# EAGLE design CNCdriver (EAGLE 7.7.0)
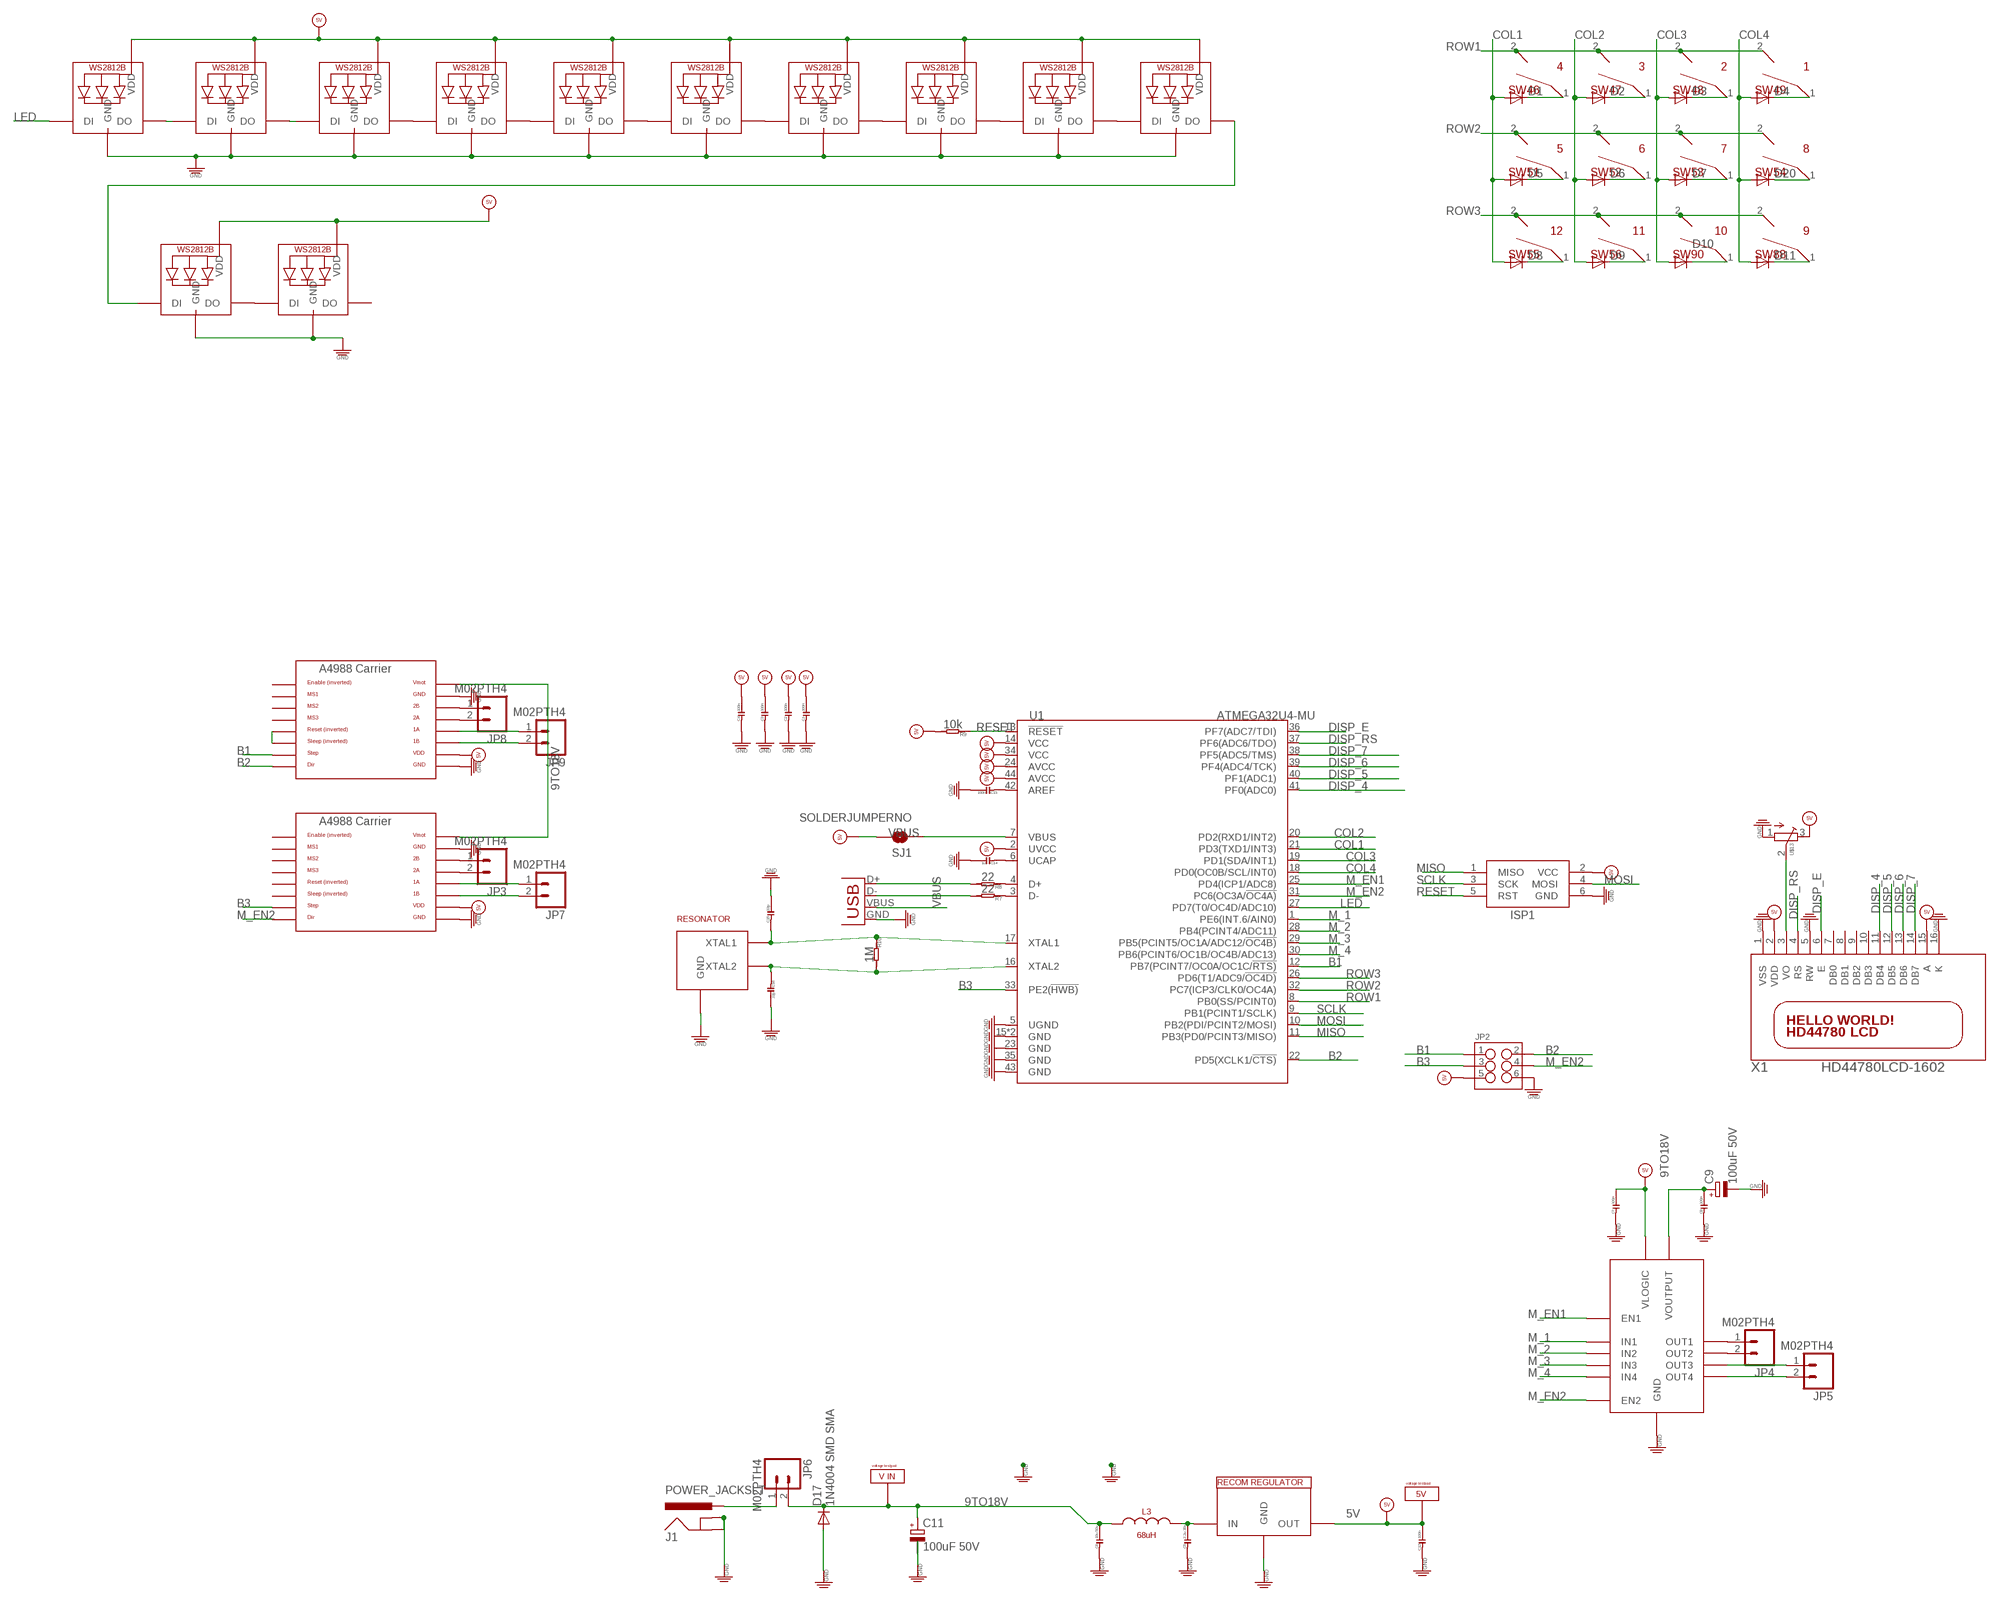
[diagram p0: schematic, sheet 1]

## Parts
C1  100n  C-0603  [C0603]
C2  100n  C-0603  [C0603]
C3  100n  C-0603  [C0603]
C4  100n  C-0603  [C0603]
C5  2.2u 35v  C-0603  [C0603]
C6  10u 50v  C-0603  [C0603]
C7  100n  C-0603  [C0603]
C8  100n  C-0603  [C0603]
C9  100uF 50V  CPOL-EU153CLV-1010  [153CLV-1010]
C11  100uF 50V  CPOL-EU153CLV-1010  [153CLV-1010]
C12  100n  C-0603  [C0603]
C13  100n  C-0603  [C0603]
C14  1u  C-0603  [C0603]
C15  22p  C-0603  [C0603]
C16  22p  C-0603  [C0603]
D1  CGRM4001-G  [SOD-123_MINI-SMA]
D2  CGRM4001-G  [SOD-123_MINI-SMA]
D3  CGRM4001-G  [SOD-123_MINI-SMA]
D4  CGRM4001-G  [SOD-123_MINI-SMA]
D5  CGRM4001-G  [SOD-123_MINI-SMA]
D6  CGRM4001-G  [SOD-123_MINI-SMA]
D7  CGRM4001-G  [SOD-123_MINI-SMA]
D8  CGRM4001-G  [SOD-123_MINI-SMA]
D9  CGRM4001-G  [SOD-123_MINI-SMA]
D10  CGRM4001-G  [SOD-123_MINI-SMA]
D11  CGRM4001-G  [SOD-123_MINI-SMA]
D17  1N4004 SMD SMA  DIODE-DO214AC  [DO214AC]
D20  CGRM4001-G  [SOD-123_MINI-SMA]
ISP1  AVRISP-6  [AVRISP]
J1  POWER_JACKSLT  [POWER_JACK_SLOT]
JP1  USB-B  USBPTH  [USB-B-PTH]
JP2  M03X2  [2X3-SHROUDED]
JP3  M02PTH4  [1X02_XTRA_BIG]
JP4  M02PTH4  [1X02_XTRA_BIG]
JP5  M02PTH4  [1X02_XTRA_BIG]
JP6  M02PTH4  [1X02_XTRA_BIG]
JP7  M02PTH4  [1X02_XTRA_BIG]
JP8  M02PTH4  [1X02_XTRA_BIG]
JP9  M02PTH4  [1X02_XTRA_BIG]
L3  68uH  L-SWRB1204S  [SWRB120XS]
LED13  WS2812B3535  [LED3535]
LED14  WS2812B3535  [LED3535]
LED15  WS2812B3535  [LED3535]
LED16  WS2812B3535  [LED3535]
LED17  WS2812B3535  [LED3535]
LED18  WS2812B3535  [LED3535]
LED19  WS2812B3535  [LED3535]
LED20  WS2812B3535  [LED3535]
LED21  WS2812B3535  [LED3535]
LED22  WS2812B3535  [LED3535]
LED23  WS2812B3535  [LED3535]
LED24  WS2812B3535  [LED3535]
R7  22  R-0603  [R0603]
R8  22  R-0603  [R0603]
R9  10k  R-0603  [R0603]
R10  1M  R-0603  [R0603]
SJ1  SOLDERJUMPERNO  [SJ_2S-NO]
SW46  4  CHERRY_MX_WITH_FIXING_PINS  [MX1A-XXNW]
SW47  3  CHERRY_MX_WITH_FIXING_PINS  [MX1A-XXNW]
SW48  2  CHERRY_MX_WITH_FIXING_PINS  [MX1A-XXNW]
SW49  1  CHERRY_MX_WITH_FIXING_PINS  [MX1A-XXNW]
SW51  5  CHERRY_MX_WITH_FIXING_PINS  [MX1A-XXNW]
SW52  6  CHERRY_MX_WITH_FIXING_PINS  [MX1A-XXNW]
SW53  7  CHERRY_MX_WITH_FIXING_PINS  [MX1A-XXNW]
SW54  8  CHERRY_MX_WITH_FIXING_PINS  [MX1A-XXNW]
SW55  12  CHERRY_MX_WITH_FIXING_PINS  [MX1A-XXNW]
SW56  11  CHERRY_MX_WITH_FIXING_PINS  [MX1A-XXNW]
SW88  9  CHERRY_MX_WITH_FIXING_PINS  [MX1A-XXNW]
SW90  10  CHERRY_MX_WITH_FIXING_PINS  [MX1A-XXNW]
U1  ATMEGA32U4-MU  [QFN44]
U$9  L293D  [SO20]
U$13  TRIMPOTTC33X  [TC33X]
U$15  A4983CARRIER  [A4988BREAKOUT]
U$16  A4983CARRIER  [A4988BREAKOUT]
U$17  RECOM_REGULATOR  [R-78E5.0-1.0]
U$25  VOLTAGETESTPAD  [POWERTESTPAD]
U$29  VOLTAGETESTPAD  [POWERTESTPAD]
U$60  RESONATOR  [16MHZXTAL]
X1  HD44780LCD-1602  [LCD1602]

## Nets
5V [power]: C1.2 C2.2 C3.2 C4.2 C7.2 C12.2 ISP1.2(VCC) JP2.5 LED13.1(VDD) LED14.1(VDD) LED15.1(VDD) LED16.1(VDD) LED17.1(VDD) LED18.1(VDD) LED19.1(VDD) LED20.1(VDD) LED21.1(VDD) LED22.1(VDD) LED23.1(VDD) LED24.1(VDD) R9.2 SJ1.2 U1.2(UVCC) U1.14(VCC) U1.24(AVCC) U1.34(VCC) U1.44(AVCC) U$9.P$20(VLOGIC) U$13.3(E) U$15.VDD U$16.VDD U$17.P$3(OUT) U$25.P$1(VOLTAGE) U$25.P$2(VOLTAGE) U$25.P$3(VOLTAGE) X1.2(VDD) X1.15(A)
9TO18V [highpower]: C6.2 C8.2 C9.+ C11.+ D17.C JP6.2 L3.P$1 U$9.P$10(VOUTPUT) U$15.VMOT U$16.VMOT U$29.P$1(VOLTAGE) U$29.P$2(VOLTAGE) U$29.P$3(VOLTAGE)
B1: JP2.1 U1.12(PB7(PCINT7/OC0A/OC1C/!RTS)) U$15.STEP
B2: JP2.2 U1.22(PD5(XCLK1/!CTS)) U$15.DIR
B3: JP2.3 U1.33(PE2(!HWB)) U$16.STEP
COL1: D1.A D5.A D8.A U1.21(PD3(TXD1/INT3))
COL2: D2.A D6.A D9.A U1.20(PD2(RXD1/INT2))
COL3: D3.A D7.A D10.A U1.19(PD1(SDA/INT1))
COL4: D4.A D11.A D20.A U1.18(PD0(OC0B/SCL/INT0))
DISP_4: U1.41(PF0(ADC0)) X1.11(DB4)
DISP_5: U1.40(PF1(ADC1)) X1.12(DB5)
DISP_6: U1.39(PF4(ADC4/TCK)) X1.13(DB6)
DISP_7: U1.38(PF5(ADC5/TMS)) X1.14(DB7)
DISP_E: U1.36(PF7(ADC7/TDI)) X1.6(E)
DISP_RS: U1.37(PF6(ADC6/TDO)) X1.4(RS)
GND: C1.1 C2.1 C3.1 C4.1 C5.1 C6.1 C7.1 C8.1 C9.- C11.- C12.1 C13.2 C14.2 C15.2 C16.2 D17.A ISP1.6(GND) J1.GND@1(GNDBREAK) J1.GND@2(GND) JP1.GND JP2.6 LED13.3(GND) LED14.3(GND) LED15.3(GND) LED16.3(GND) LED17.3(GND) LED18.3(GND) LED19.3(GND) LED20.3(GND) LED21.3(GND) LED22.3(GND) LED23.3(GND) LED24.3(GND) U1.5(UGND) U1.15(GND) U1.23(GND) U1.35(GND) U1.43(GND) U1.TAB(GND) U$9.P$4(GND) U$9.P$5(GND) U$9.P$6(GND) U$9.P$7(GND) U$9.P$14(GND) U$9.P$15(GND) U$9.P$16(GND) U$9.P$17(GND) U$13.1(A) U$15.GND U$15.GND@0(GND) U$16.GND U$16.GND@0(GND) U$17.P$2(GND) U$60.P$2(GND) U$60.P$4(GND) X1.1(VSS) X1.5(RW) X1.16(K)
LED: LED13.4(DI) U1.27(PD7(T0/OC4D/ADC10))
M_1: U1.1(PE6(INT.6/AIN0)) U$9.P$2(IN1)
M_2: U1.28(PB4(PCINT4/ADC11)) U$9.P$9(IN2)
M_3: U1.29(PB5(PCINT5/OC1A/ADC12/!OC4B)) U$9.P$12(IN3)
M_4: U1.30(PB6(PCINT6/OC1B/OC4B/ADC13)) U$9.P$19(IN4)
M_EN1: U1.25(PD4(ICP1/ADC8)) U$9.P$1(EN1)
M_EN2: JP2.4 U1.31(PC6(OC3A/!OC4A)) U$9.P$11(EN2) U$16.DIR
MISO: ISP1.1(MISO) U1.11(PB3(PD0/PCINT3/MISO))
MOSI: ISP1.4(MOSI) U1.10(PB2(PDI/PCINT2/MOSI))
N$1: D1.C SW46.1
N$2: D2.C SW47.1
N$3: D3.C SW48.1
N$4: D4.C SW49.1
N$5: D5.C SW51.1
N$6: D6.C SW52.1
N$7: D7.C SW53.1
N$8: D8.C SW55.1
N$9: D9.C SW56.1
N$10: D10.C SW90.1
N$11: D11.C SW88.1
N$12: U$15.RST U$15.SLP(SLEEP)
N$13 [highpower]: JP7.1 U$16.1A
N$14 [highpower]: JP7.2 U$16.1B
N$15 [highpower]: JP3.2 U$16.2A
N$16 [highpower]: JP3.1 U$16.2B
N$17 [highpower]: JP9.1 U$15.1A
N$18 [highpower]: JP9.2 U$15.1B
N$19 [highpower]: JP8.2 U$15.2A
N$20: D20.C SW54.1
N$21 [highpower]: J1.PWR JP6.1
N$22 [highpower]: C5.2 L3.P$2 U$17.P$1(IN)
N$23 [highpower]: JP8.1 U$15.2B
N$25: U$13.2(S) X1.3(VO)
N$26 [highpower]: JP4.1 U$9.P$3(OUT1)
N$27 [highpower]: JP4.2 U$9.P$8(OUT2)
N$28 [highpower]: JP5.1 U$9.P$13(OUT3)
N$29 [highpower]: JP5.2 U$9.P$18(OUT4)
N$48: LED13.2(DO) LED14.4(DI)
N$70: LED14.2(DO) LED15.4(DI)
N$71: LED15.2(DO) LED16.4(DI)
N$72: LED16.2(DO) LED17.4(DI)
N$73: LED18.2(DO) LED19.4(DI)
N$74: LED19.2(DO) LED20.4(DI)
N$75: LED20.2(DO) LED21.4(DI)
N$76: LED21.2(DO) LED22.4(DI)
N$77: LED17.2(DO) LED18.4(DI)
N$80: LED23.2(DO) LED24.4(DI)
N$90: LED22.2(DO) LED23.4(DI)
N$99: JP1.D- R7.2
N$100: JP1.D+ R8.2
N$110: C13.1 U1.42(AREF)
N$111: R8.1 U1.4(D+)
N$117: R7.1 U1.3(D-)
N$118: C14.1 U1.6(UCAP)
N$119: C15.1 R10.1 U1.17(XTAL1) U$60.P$1(XTAL1)
N$120: C16.1 R10.2 U1.16(XTAL2) U$60.P$3(XTAL2)
RESET: ISP1.5(RST) R9.1 U1.13(!RESET)
ROW1: SW46.2 SW47.2 SW48.2 SW49.2 U1.8(PB0(SS/PCINT0))
ROW2: SW51.2 SW52.2 SW53.2 SW54.2 U1.32(PC7(ICP3/CLK0/OC4A))
ROW3: SW55.2 SW56.2 SW88.2 SW90.2 U1.26(PD6(T1/ADC9/!OC4D))
SCLK: ISP1.3(SCK) U1.9(PB1(PCINT1/SCLK))
VBUS: JP1.VBUS SJ1.1 U1.7(VBUS)
Unconnected: LED24.2(DO) U$15.EN U$15.MS1 U$15.MS2 U$15.MS3 U$16.EN U$16.MS1 U$16.MS2 U$16.MS3 U$16.RST U$16.SLP(SLEEP) X1.7(DB0) X1.8(DB1) X1.9(DB2) X1.10(DB3)

## Library data of the parts
C1-C8 C12-C16 = OPL:C*
C9 C11 = rcl:CPOL-EU: POLARIZED CAPACITOR, European symbol
D1-D11 D20 = diode:CGRM400*-G: Molded plasitc,JEDEC SOD-123/Mini SMA Source: Comchip CGRM4001-G.pdf
D17 = diode:DIODE-: DIODE
ISP1 = adafruit:AVRISP: AVR ISP HEADER Standard 6 pin header for AVR programming
J1 = SparkFun-Connectors:POWER_JACK: Power Jack This is the standard 5.5mm barrel jack for power. The PTH is the most common, proven, reliable, footprint. The Slot footprint only works if the mill layer is transmitted to the PCB fab house so be warned. Spark Fun Electronics SKU : PRT-00119 SMT: CONN-08106 Mating wall wart : TOL-00298 (and others)
JP1 = SparkFun-Connectors:USB: USB Connectors USB-B-PTH is fully proven SKU : PRT-00139/CONN-08278 USB-miniB is fully proven SKU : PRT-00587 USB-A-PCB is untested. USB-A-H is throughly reviewed, but untested. Spark Fun Electronics SKU : PRT-00437 USB-B-SMT is throughly reviewed, but untested. Needs silkscreen touching up. USB-A-S has not been used/tested USB-MB-H has not been used/tested USB-MICROB has been used. CONN-09505; PROD_ID: CONN-08278
JP2 = SparkFun-Connectors:M03X2: 2x3 .1" header. Shrouded, with keying- CONN-10681 SMT- CONN-11415 Pogo pins- HW-11044; PROD_ID: CONN-10681
JP3-JP9 = SparkFun-Connectors:M02: Standard 2-pin 0.1" header. Use with - straight break away headers ( PRT-00116) - right angle break away headers (PRT-00553) - swiss pins (PRT-00743) - machine pins (PRT-00117) - female headers (PRT-00115) Molex polarized connector foot print use with: PRT-08233 with associated crimp pins and housings. 2.54_SCREWTERM for use with PRT-10571. 3.5mm Screw Terminal footprints for PRT-08084 5mm Screw Terminal footprints for use with PRT-08433
L3 = EurorackModularParts:L
LED13-LED24 = EurorackModularParts:WS2812B
R7-R10 = OPL:R*
SJ1 = SparkFun-Passives:SOLDERJUMPER: Solder Jumper Standard SMD solder jumper. Used to automate production. Two varients : Normally Open and Normally Closed are the same, but have different paste layers. NC will have a large amount of paste and should jumper during reflow.
SW46-SW49 SW51-SW56 SW88 SW90 = Cherry_MX_v7.0:CHERRY_MX
U1 = IC:ATMEGA32U4: 8-bit Microcontroller With 16/32K Bytes of ISP Flash and USB controller
U$9 = EurorackModularParts:L293D
U$13 = adafruit:TRIMPOT: SMT trimmer potentiometer part number TC33X http://www.ladyada.net/library/eagle
U$15 U$16 = RepRapjr:A4983CARRIER
U$17 = EurorackModularParts:RECOM_REGULATOR
U$25 = FenixBase:VOLTAGETESTPAD; DESC: 5V
U$29 = FenixBase:VOLTAGETESTPAD; DESC: V IN
U$60 = EurorackModularParts:RESONATOR
X1 = adafruit:HD44780LCD: HD44780 LCD Standard character type LCDs, available in sizes from 8x1 to 40x4!

## Net classes
0 default: width 0.254 mm
1 power: width 0.254 mm
2 highpower: width 0.508 mm

## Board
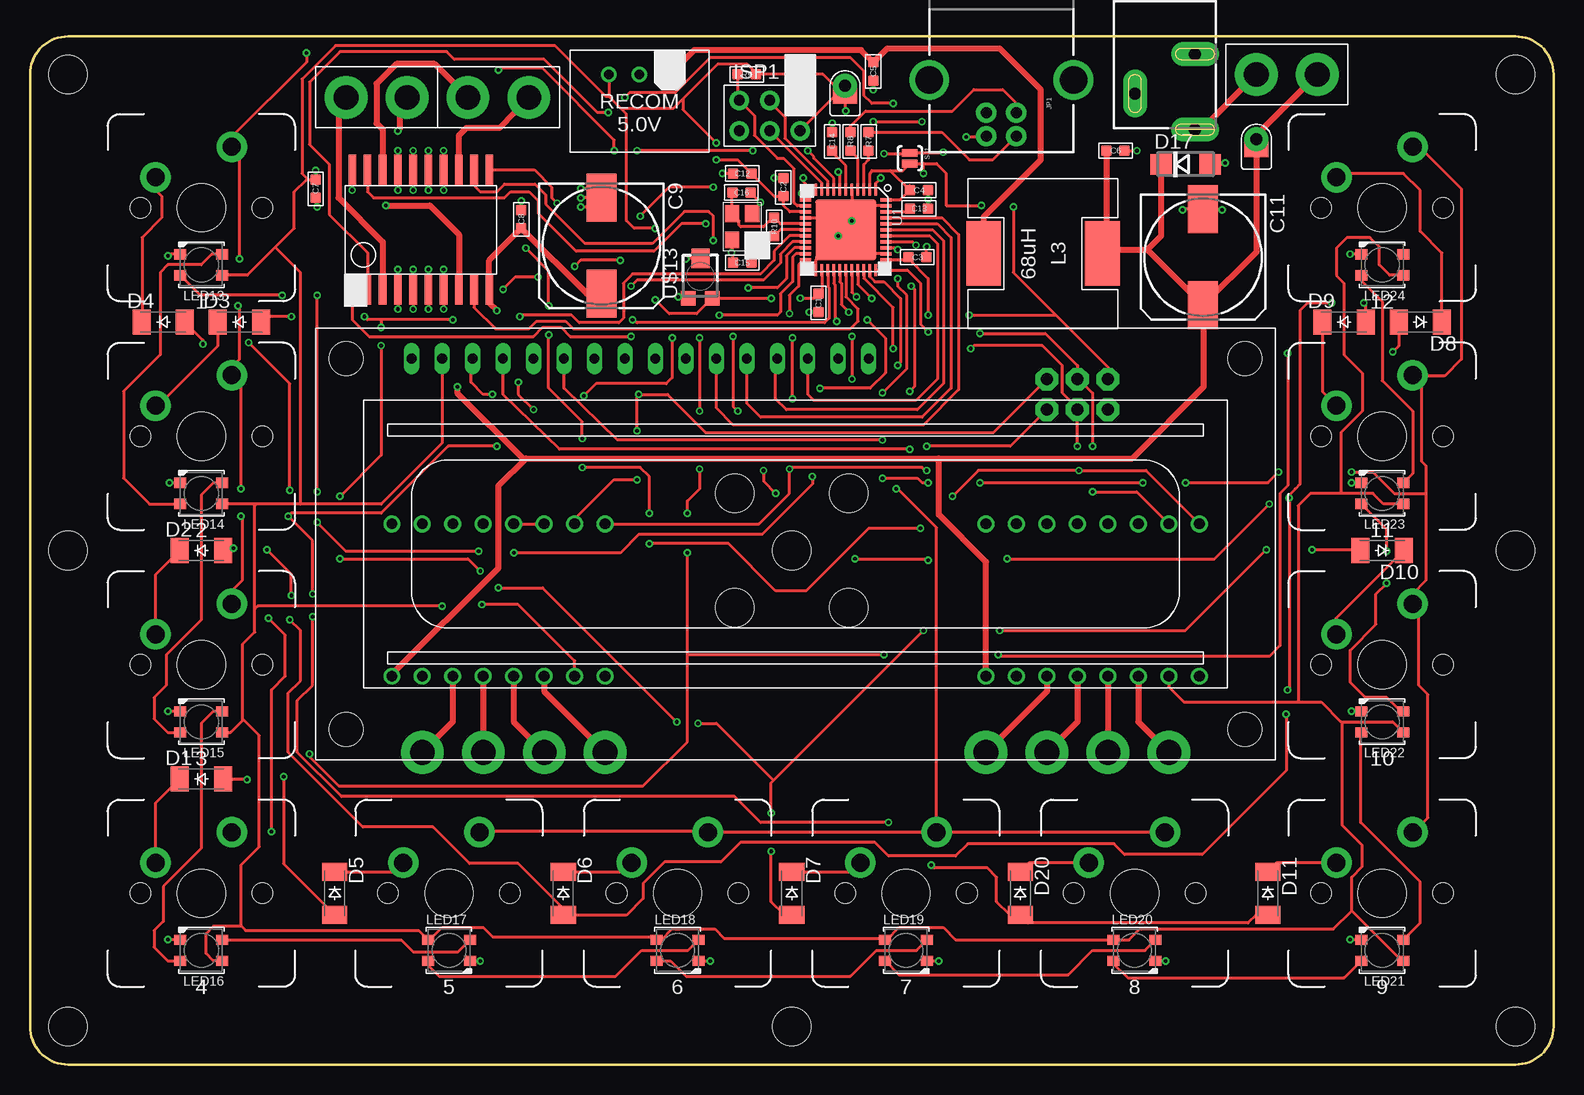
[diagram p1: board, top side]
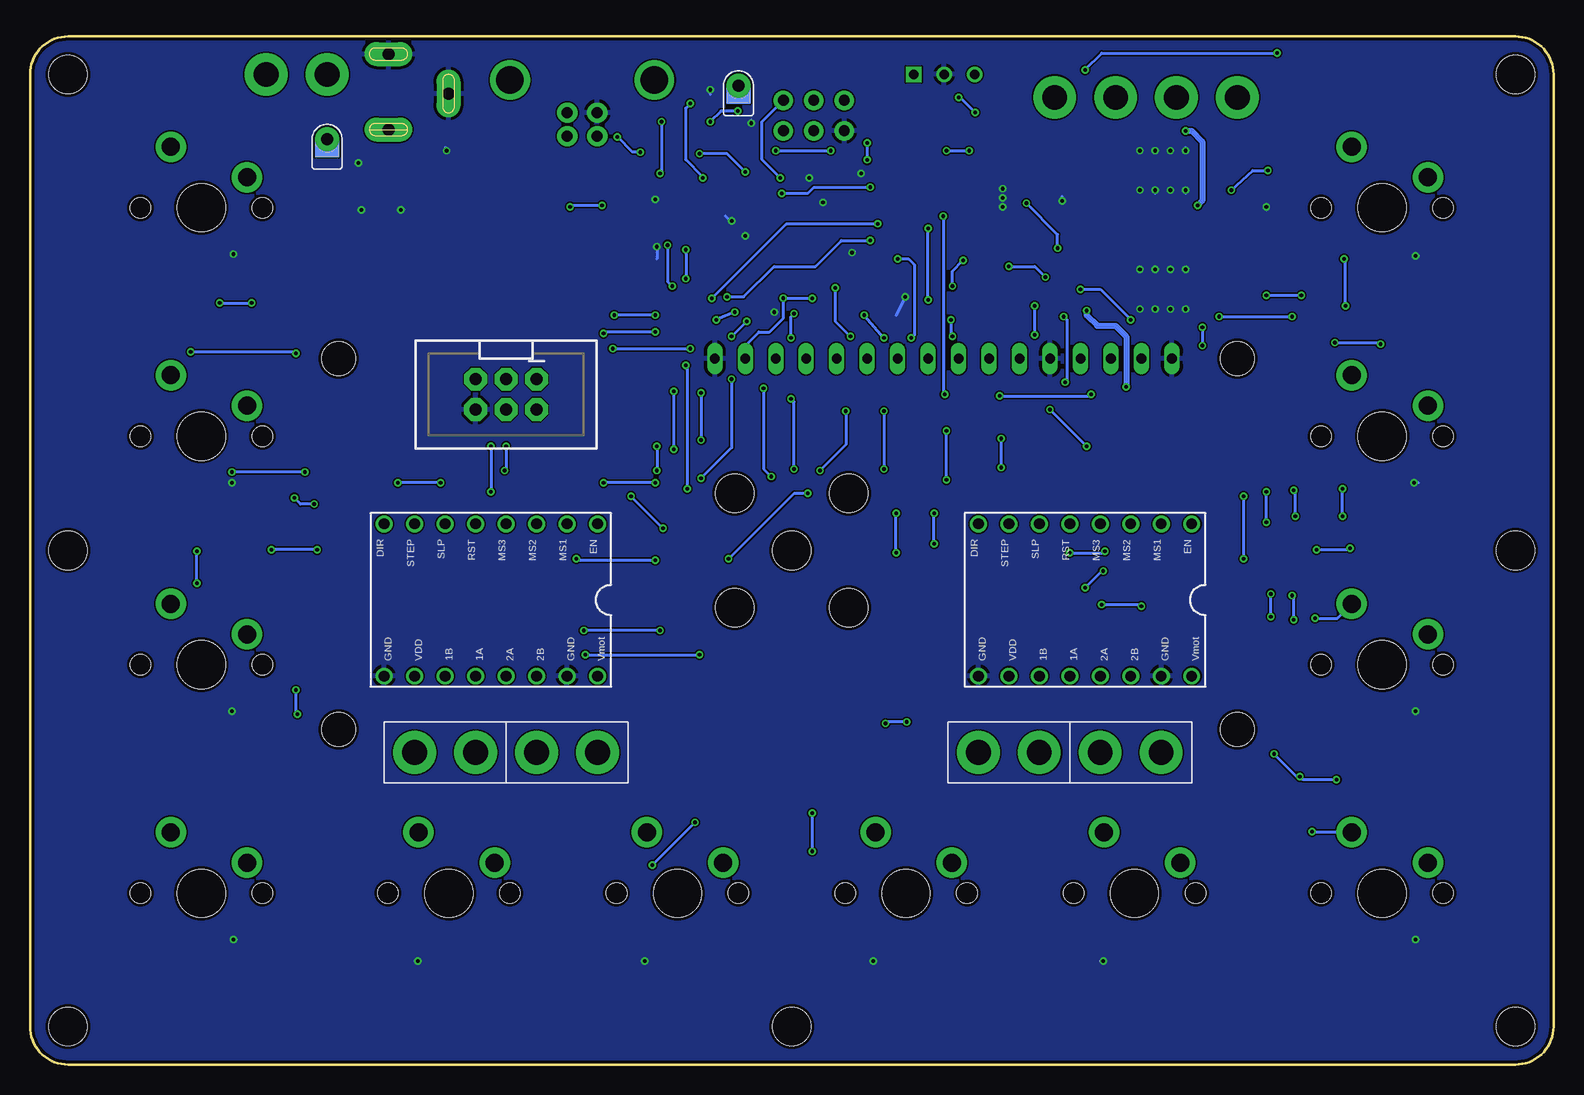
[diagram p2: board, bottom side, seen from below]

Size 127 x 85.72 mm. Coordinates in mm from the lower left corner, seen from the top.
Outline: 3.18,85.72 123.82,85.72 arc-90 127,82.55 127,3.17 arc-90 123.82,0 3.18,0 arc-90 0,3.17 0,82.55 arc-90 3.18,85.72
Copper layers (1*16): Top 0.035mm / dielectric 1.5mm / Bottom 0.035mm
Design rules "dirt_cheap_dirty_boards.v1": minimum track width 5mil, minimum drill 12mil, track to track 5mil, track to pad 5mil, pad to pad 5mil, via to via 5mil, smd to smd 0mil, copper to edge 10mil, drill to drill 10mil, minimum pad ring 10mil, minimum via ring 6mil, stop-mask expansion 2mil, vias tented up to drill 25mil, thermal gap 10mil
Holes 3.2 mm at 3.18,3.17 123.83,3.17 3.18,82.55 123.83,82.55 3.18,42.86 123.83,42.86 63.5,3.17 63.5,42.86 58.74,47.62 68.26,47.62 68.26,38.1 58.74,38.1

### Footprints (pad centres in the part's own frame; a part is rotated, then mirrored left to right if it is on the bottom)
C0603 = smd 0.889 x 0.889: 1 -0.762,0; 2 0.762,0
153CLV-1010 = smd 4 x 2.5: + 4,0; - -4,0
SOD-123_MINI-SMA = smd 1.5 x 2.1: A 1.8,0; C -1.8,0
DO214AC = smd 1.8 x 1.7: A 2.05,0; C -2.05,0
AVRISP = drill 0.9 pad 1.626: 1 -1.27,2.54; 2 1.27,2.54; 3 -1.27,0; 4 1.27,0; 5 -1.27,-2.54; 6 1.27,-2.54
POWER_JACK_SLOT = drill 1 pad 2 long: GND@1 2.58,7.5; GND@2 7.58,10.8; PWR 2.58,13.8
USB-B-PTH = drill 0.914 pad 1.676: D+ 0,1.25; D- 1.981,1.25; GND 0,-1.25; VBUS 1.981,-1.25 | drill 2.286: S1 -2.718,-6.02; S2 -2.718,6.02
2X3-SHROUDED = drill 1.016 pad 1.88 octagon: 1 -1.27,2.54; 2 1.27,2.54; 3 -1.27,0; 4 1.27,0; 5 -1.27,-2.54; 6 1.27,-2.54
1X02_XTRA_BIG = drill 2.057 pad 3.556: 1 -2.54,0; 2 2.54,0
SWRB120XS = smd 2.9 x 5.4: P$1 -4.95,0; P$2 4.95,0
LED3535 = smd 1 x 0.85: 1 -1.75,0.875; 2 -1.75,-0.875; 3 1.75,-0.875; 4 1.75,0.875
R0603 = smd 0.889 x 0.889: 1 -0.762,0; 2 0.762,0
SJ_2S-NO = smd 0.635 x 1.27: 1 -0.45,0; 2 0.45,0
MX1A-XXNW = drill 1.5 pad 2.54: 1 -3.81,2.54; 2 2.54,5.08 | hole 4: 0,0 | hole 1.7: -5.08,0; 5.08,0
QFN44 = smd 1 x 0.3: 1 -3.35,2.5; 2 -3.35,2; 3 -3.35,1.5; 4 -3.35,1; 5 -3.35,0.5; 6 -3.35,0; 7 -3.35,-0.5; 8 -3.35,-1; 9 -3.35,-1.5; 10 -3.35,-2; 11 -3.35,-2.5; 23 3.35,-2.5; 24 3.35,-2; 25 3.35,-1.5; 26 3.35,-1; 27 3.35,-0.5; 28 3.35,0; 29 3.35,0.5; 30 3.35,1; 31 3.35,1.5; 32 3.35,2; 33 3.35,2.5 | smd 0.3 x 1: 12 -2.5,-3.35; 13 -2,-3.35; 14 -1.5,-3.35; 15 -1,-3.35; 16 -0.5,-3.35; 17 0,-3.35; 18 0.5,-3.35; 19 1,-3.35; 20 1.5,-3.35; 21 2,-3.35; 22 2.5,-3.35; 34 2.5,3.35; 35 2,3.35; 36 1.5,3.35; 37 1,3.35; 38 0.5,3.35; 39 0,3.35; 40 -0.5,3.35; 41 -1,3.35; 42 -1.5,3.35; 43 -2,3.35; 44 -2.5,3.35 | smd 5.08 x 5.08: TAB 0,0
SO20 = smd 0.635 x 2.5: P$1 -5.715,-5; P$2 -4.445,-5; P$3 -3.175,-5; P$4 -1.905,-5; P$5 -0.635,-5; P$6 0.635,-5; P$7 1.905,-5; P$8 3.175,-5; P$9 4.445,-5; P$10 5.715,-5; P$11 5.715,5; P$12 4.445,5; P$13 3.175,5; P$14 1.905,5; P$15 0.635,5; P$16 -0.635,5; P$17 -1.905,5; P$18 -3.175,5; P$19 -4.445,5; P$20 -5.715,5
TC33X = smd 1.2 x 1.2: 1 -1,-1.825; 3 1,-1.825 | smd 1.5 x 1.6: 2 0,1.5
A4988BREAKOUT = drill 0.9: 1A 8.89,1.27; 1B 11.43,1.27; 2A 6.35,1.27; 2B 3.81,1.27; DIR 16.51,-11.43; EN -1.27,-11.43; GND 16.51,1.27; GND@0 1.27,1.27; MS1 1.27,-11.43; MS2 3.81,-11.43; MS3 6.35,-11.43; RST 8.89,-11.43; SLP 11.43,-11.43; STEP 13.97,-11.43; VDD 13.97,1.27; VMOT -1.27,1.27
R-78E5.0-1.0 = drill 0.8 square: P$1 -2.54,0 | drill 0.8: P$2 0,0; P$3 2.54,0
POWERTESTPAD = drill 1 pad 2: P$1 0,0 | smd 2 x 1.5: P$2 0,-0.75 | smd 2 x 1.5 bottom: P$3 0,-0.75
16MHZXTAL = smd 1.4 x 1.2: P$1 -1.1,-0.85; P$2 1.1,-0.85; P$3 1.1,0.85; P$4 -1.1,0.85
LCD1602 = drill 0.8 long: 1 8,33.46; 2 10.54,33.46; 3 13.08,33.46; 4 15.62,33.46; 5 18.16,33.46; 6 20.7,33.46; 7 23.24,33.46; 8 25.78,33.46; 9 28.32,33.46; 10 30.86,33.46; 11 33.4,33.46; 12 35.94,33.46; 13 38.48,33.46; 14 41.02,33.46; 15 43.56,33.46; 16 46.1,33.46 | hole 2.8: 2.54,2.54; 2.54,33.46; 77.46,33.46; 77.46,2.54

### Placement (x,y rotation side)
C1  65.72,63.5 90 top
C2  62.8,73.15 270 top
C3  73.98,67.31 180 top
C4  74.1,72.9 180 top
C5  70.29,82.8 90 top
C6  90.49,76.2 180 top
C7  23.81,73.02 90 top
C8  40.96,70.48 270 top
C9  47.62,68.26 270 top
C11  97.79,67.31 270 top
C12  59.37,74.3 0 top
C13  74.1,71.37 0 top
C14  66.87,76.96 90 top
C15  59.37,66.87 180 top
C16  59.31,72.71 0 top
D1  14.29,23.81 0 top
D2  14.29,42.86 0 top
D3  17.46,61.91 0 top
D4  11.11,61.91 0 top
D5  25.4,14.29 270 top
D6  44.45,14.29 270 top
D7  63.5,14.29 270 top
D8  115.89,61.91 180 top
D9  109.54,61.91 0 top
D10  112.71,42.86 180 top
D11  103.19,14.29 270 top
D17  96.33,75.06 0 top
D20  82.55,14.29 270 top
ISP1  61.66,79.12 270 top
J1  99.7,91.76 180 top
JP1  80.96,79.38 270 top
JP2  87.31,55.88 270 bottom
JP3  82.23,26.04 180 bottom
JP4  28.89,80.64 0 top
JP5  39.05,80.64 180 top
JP6  104.78,82.55 0 top
JP7  92.39,26.04 180 bottom
JP8  35.24,26.04 180 bottom
JP9  45.4,26.04 180 bottom
L3  84.45,67.63 180 top
LED13  14.29,66.67 180 top
LED14  14.29,47.62 180 top
LED15  14.29,28.57 180 top
LED16  14.29,9.52 180 top
LED17  34.93,9.52 0 top
LED18  53.98,9.52 0 top
LED19  73.03,9.52 0 top
LED20  92.08,9.52 0 top
LED21  112.71,9.52 180 top
LED22  112.71,28.57 180 top
LED23  112.71,47.62 180 top
LED24  112.71,66.67 180 top
R7  69.91,76.96 90 top
R8  68.39,76.96 90 top
R9  59.75,82.55 0 top
R10  62.04,69.85 90 top
SJ1  73.34,75.56 270 top
SW46  14.29,14.29 0 top
SW47  14.29,33.34 0 top
SW48  14.29,52.39 0 top
SW49  14.29,71.44 0 top
SW51  34.93,14.29 0 top
SW52  53.98,14.29 0 top
SW53  73.03,14.29 0 top
SW54  92.08,14.29 0 top
SW55  112.71,71.44 0 top
SW56  112.71,52.39 0 top
SW88  112.71,14.29 0 top
SW90  112.71,33.34 0 top
U1  68.01,69.6 270 top
U$9  32.58,69.6 0 top
U$13  55.88,65.72 0 top
U$15  31.43,33.66 180 bottom
U$16  80.96,33.66 180 bottom
U$17  50.8,82.55 180 top
U$25  67.94,81.6 0 top
U$29  102.23,77.15 0 top
U$60  59.37,69.85 90 top
X1  23.81,25.4 0 top

### Tracks (layer width: path | path; a pad name or v marks a point on that pad's centre or on a via)
5V  (via drill 0.3)
  Top 0.254: U1.34 73,67.1 C3.2 | U1.44 72.54,72.1 C4.2 | 70.17,74.55 70.04,74.3 | U1.2 70.01,74.26 70.17,74.55 | 70.17,74.55 71.69,74.55 | 71.69,74.55 C4.2 | U1.14 63.33,71.1 62.8,71.63 C2.2 62.04,72.39 C12.2 58.99,75.44 v57.21,75.44 | C4.2 73.34,73.28 | 60.64,82.55 66.1,82.55 67.81,80.85 U$25.P$3 67.94,79.57 v68.01,79.5 | 60.64,82.55 R9.2 | ISP1.2 U$25.P$1 | C3.2 73.22,67.18 74.87,65.53 v74.87,62.48 | U1.24 66.01,64.55 C1.2 65.36,63.9 v64.2,63.9 | JP2.5 89.85,58.17 85.53,62.48 | U$9.P$20 v26.86,72.9 | v23.81,74.55 23.94,73.79 C7.2 23.18,73.79 | X1.2 34.35,51.81 29.27,46.74 22.54,46.74 | 22.54,46.74 18.86,46.74 | 18.86,46.74 16.05,46.74 LED14.1 | 20.45,68.13 18.11,65.8 LED13.1 | 20.45,68.13 22.03,69.72 22.03,72.77 23.05,73.79 23.18,73.79 | U$17.P$3 48.26,80.71 | 48.26,80.71 49.21,79.76 | 49.21,79.76 53.66,79.76 54.42,80.52 | 54.42,80.52 57.34,83.44 59.75,83.44 60.64,82.55 | 48.26,80.71 48.01,80.71 43.75,84.96 25.46,84.96 22.67,82.17 22.67,74.3 23.18,73.79 | 54.42,80.52 54.42,79.63 v57.21,76.83 | C3.2 73.22,67.44 | v78.3,62.48 85.53,62.48 | v79.31,71.63 76.39,71.63 76.39,74.3 75.57,75.11 74.49,75.11 | v81.98,71.5 81.98,66.04 85.53,62.48 | v61.79,63.88 61.51,63.9 U$13.3 56.85,63.9 55.56,62.61 53.28,62.61 v52.13,63.75 | 22.54,46.74 22.54,66.04 20.45,68.13 | U$16.VDD 94.93,31.5 96.2,30.23 105.73,30.23 | 105.73,30.23 107.63,30.23 109.28,28.57 | 109.28,28.57 113.59,28.57 LED22.1 | LED23.1 112.83,46.75 111.95,47.62 109.28,47.62 | 109.28,47.62 106.74,47.62 105.73,46.61 105.73,30.23 | LED21.1 114.35,8.65 110.17,12.83 | 110.17,12.83 110.17,15.62 111.06,16.51 111.06,18.29 109.41,19.94 109.41,28.45 109.28,28.57 | 110.17,12.83 108.65,11.3 92.52,11.3 91.62,10.4 LED20.1 90.31,10.41 77.15,10.41 76.14,11.43 72.45,11.43 71.42,10.4 LED19.1 71.13,10.54 57.85,10.54 57.09,11.3 53.53,11.3 52.63,10.4 LED18.1 51.96,10.67 38.54,10.67 37.78,11.43 34.35,11.43 33.32,10.4 LED17.1 32.4,11.18 17.97,11.18 17.59,11.56
  Top 0.254: LED16.1 15.29,8.65 14.67,9.27 14.67,10.92 15.3,11.56 17.59,11.56 | LED15.1 16.71,27.7 17.72,28.7 17.72,28.83 | 17.72,28.83 17.72,35.05 18.73,36.07 18.73,37.97 | 18.73,37.97 18.73,46.61 18.86,46.74 | U$15.VDD 45.4,33.66 40.7,38.35 v37.66,38.35 | v34.35,38.23 18.99,38.23 18.73,37.97 | LED24.1 113.33,65.8 112.46,66.67 112.46,68.2 111.7,68.96 109.79,68.96 108.9,68.07 108.9,65.79 109.54,65.15 109.54,59.18 111.06,57.66 111.06,54.48 109.28,52.7 109.28,47.62 | 17.59,11.56 17.59,16.64 19.11,18.16 19.11,27.43 17.72,28.83 | v52.13,69.72 50.36,69.72 49.72,70.36 49.72,79.25 49.21,79.76 | 71.69,74.55 72.78,74.55 SJ1.2 74.49,75.11 | v70.29,78.61 v74.36,78.61 | v74.49,74.3 74.49,75.11
  Bottom 0.254: v26.86,72.9 25.08,74.55 v23.81,74.55 | v57.21,76.83 v57.21,75.44 | v74.87,62.48 v78.3,62.48 | v79.31,71.63 81.85,71.63 v81.98,71.5 | X1.15 67.37,59.95 66.23,61.09 65.34,61.09 64.2,62.23 v64.2,63.9 64.18,63.88 v61.79,63.88 | v37.66,38.35 34.48,38.35 v34.35,38.23 | v52.13,63.75 v52.13,69.72 | v68.01,79.5 69.41,79.5 v70.29,78.61 | v74.36,78.61 74.36,74.42 v74.49,74.3
9TO18V  (via drill 0.3)
  Top 0.508: C6.2 89.73,67.95 | 89.73,67.95 L3.P$1 | 89.73,67.95 93.15,67.95 | 93.15,67.95 C11.+ | U$29.P$3 102.23,67.75 C11.+ | U$29.P$1 102.23,77.47 JP6.2 | D17.C 94.28,69.08 93.15,67.95 | C9.+ 46.42,64.26 C8.2 38.29,67.06 U$9.P$10 38.29,63.5 v38.93,62.86 | v35.62,56.52 35.62,56.01 41.08,50.55 41.34,50.55 | 41.34,50.55 75.76,50.55 | 75.76,50.55 91.88,50.55 97.85,56.52 97.85,63.25 C11.+ | U$15.VMOT 30.16,32.51 39.05,41.4 39.05,48.26 41.34,50.55 | U$16.VMOT 79.69,41.91 75.76,45.85 75.76,50.55
  Bottom 0.508: v38.93,62.86 38.93,62.48 38.04,61.59 36.51,61.59 35.62,60.71 v35.62,56.52
B1  (via drill 0.3)
  Top 0.254: U1.12 64.66,72.31 v64.33,72.64 | v56.96,73.15 53.28,73.15 v50.86,70.74 | JP2.1 80.33,52.7 56.32,52.7 53.15,55.88 v50.74,55.88 50.61,55.75 v50.61,52.83 | U$15.STEP 45.4,45.47 48.7,48.77 v50.61,48.77
  Bottom 0.254: v64.33,72.64 62.17,72.64 61.66,73.15 v56.96,73.15 | v50.86,70.74 50.86,56.01 v50.74,55.88 | v50.61,48.77 v50.61,52.83
B2  (via drill 0.3)
  Top 0.254: U1.22 64.49,67.1 64.07,66.67 64.07,64.9 63.31,64.14 v63.31,62.61 | U$15.DIR 60.77,45.08 63.31,47.62 v63.31,49.66 63.44,49.78 74.36,49.78 74.61,49.53 v74.74,49.53 | v63.56,55.5 v63.56,60.58 | JP2.2 81.72,51.56 v74.74,51.56
  Bottom 0.254: v63.31,49.66 63.31,55.24 v63.56,55.5 | v63.56,60.58 63.56,62.36 v63.31,62.61 | v74.74,51.56 v74.74,49.53
B3  (via drill 0.3)
  Top 0.254: v88.58,51.56 88.58,56.01 87.44,57.15 JP2.3 87.31,58.29 84.65,60.96 v79.18,60.96 | v88.58,47.75 92.27,47.75 U$16.STEP | U1.33 73.14,66.25 74.23,65.15 74.23,61.72 v74.87,61.09
  Bottom 0.254: v88.58,51.56 v88.58,47.75 | v74.87,61.09 79.06,61.09 v79.18,60.96
COL1  (via drill 0.3)
  Top 0.254: U1.21 63.85,67.6 63.56,67.31 63.56,65.28 62.55,64.26 62.55,62.74 62.29,62.48 v57.47,62.48 | D1.A 18.03,23.81 v18.1,23.75 | v21.15,24 21.15,16.74 D5.A | v23.3,25.91 23.3,25.65 25.72,23.24 51.12,23.24 54.8,26.92 54.8,34.16 | 54.8,34.16 v54.8,42.67 | v54.8,45.97 54.8,46.99 55.82,48.01 v55.82,49.66 | v55.82,60.58 v55.82,54.48 | D8.A 114.09,59.92 v113.6,59.44 | v104.84,59.31 104.84,48.26 104.2,47.62 104.2,34.92 103.31,34.04 80.84,34.04 v80.71,34.16 | v71.18,34.16 54.8,34.16
  Bottom 0.254: v18.1,23.75 20.89,23.75 v21.15,24 21.4,24 v23.3,25.91 | v54.8,42.67 v54.8,45.97 | v57.47,62.48 v55.82,60.58 | v55.82,54.48 v55.82,49.66 | v113.6,59.44 104.97,59.44 v104.84,59.31 | v80.71,34.16 v71.18,34.16
COL2  (via drill 0.3)
  Top 0.254: U1.20 63.71,68.1 63.06,67.44 63.06,65.53 62.29,64.77 v59.88,64.77 | v21.65,37.08 22.54,36.2 22.54,32 21.53,30.99 21.53,26.04 27.75,19.81 33.59,19.81 36.64,16.76 40.7,16.76 44.45,13.02 D6.A 44.49,12.45 49.72,12.45 51.12,13.84 51.12,15.11 52.9,16.89 57.59,16.89 59.25,18.54 70.42,18.54 71.56,17.4 77.15,17.4 78.17,18.41 90.36,18.41 91.25,17.53 97.73,17.53 104.71,24.51 v104.71,29.21 | v21.78,39.12 21.78,40.89 v19.75,42.93 | v16.95,43.05 16.28,43.05 D2.A | D9.A 111.34,63.35 v111.19,63.5 | v108.52,63.5 106.49,63.5 105.85,62.86 105.85,48.39 105.47,48.01 104.97,47.5 v104.97,47.24 104.97,31.37 v104.84,31.24 | v58.61,60.71 58.61,54.86 v58.99,54.48 | v61.15,49.53 61.15,48.64 v62.17,47.62 | v68.77,42.16 74.74,42.16 v74.87,42.04 | v81.47,42.16 98.74,42.16 v103.31,46.74
  Bottom 0.254: v21.65,37.08 21.65,38.99 v21.78,39.12 | v19.75,42.93 17.08,42.93 v16.95,43.05 | v111.19,63.5 v108.52,63.5 | v104.84,31.24 104.84,29.34 v104.71,29.21 | v59.88,64.77 59.88,61.98 v58.61,60.71 | v58.99,54.48 58.99,51.69 v61.15,49.53 | v62.17,47.62 63.31,47.62 v68.77,42.16 | v74.87,42.04 81.34,42.04 v81.47,42.16 | v103.31,46.74 104.46,46.74 v104.97,47.24
COL3  (via drill 0.3)
  Top 0.254: U1.19 63.58,68.6 62.55,67.56 62.55,66.8 61.15,65.41 50.61,65.41 v50.1,64.9 | D7.A 62.89,12.49 61.79,13.59 v61.79,17.78 | v61.79,20.96 61.79,23.5 61.98,23.69 | 61.98,23.69 v74.49,36.2 | v80.84,36.2 96.33,36.2 v103.06,42.93 | v106.87,42.93 110.85,42.93 D10.A | v49.21,67.06 45.91,67.06 v45.4,66.55 | v42.35,65.66 40.45,65.66 v39.43,64.64 | v35.24,62.1 29.27,62.1 | 29.27,62.1 28.13,62.1 v27.88,62.36 | v21.78,62.36 19.71,62.36 D3.A | 29.27,62.1 v29.27,61.47 | v29.27,59.94 29.27,50.8 v25.84,47.37 | v25.84,42.16 36.51,42.16 v37.53,41.15 | v39.05,39.75 42.74,39.75 v53.91,28.57 | v55.69,28.45 57.21,28.45 61.98,23.69
  Bottom 0.254: v61.79,17.78 v61.79,20.96 | v74.49,36.2 v80.84,36.2 | v103.06,42.93 v106.87,42.93 | v50.1,64.9 50.1,66.17 v49.21,67.06 | v45.4,66.55 43.24,66.55 v42.35,65.66 | v39.43,64.64 37.78,64.64 v35.24,62.1 | v27.88,62.36 v21.78,62.36 | v29.27,61.47 v29.27,59.94 | v25.84,47.37 v25.84,42.16 | v37.53,41.15 37.66,41.15 v39.05,39.75 | v53.91,28.57 55.56,28.57 v55.69,28.45
COL4  (via drill 0.3)
  Top 0.254: U1.18 63.32,69.1 62.04,67.82 62.04,67.06 60.9,65.91 50.23,65.91 49.47,65.15 49.47,62.23 49.09,61.85 45.78,61.85 45.15,62.48 40.96,62.48 v40.83,62.36 | D11.A 102.21,12.49 101.54,11.81 83.23,11.81 D20.A 81.68,12.49 80.58,13.59 80.58,15.62 79.82,16.38 75.37,16.38 v75.12,16.64 | v71.56,20.19 60.9,20.19 58.74,22.35 25.97,22.35 22.29,26.04 22.29,30.35 23.56,31.62 v23.56,37.34 | v23.56,39.24 23.56,43.69 v21.53,45.72 21.78,45.97 29.27,45.97 34.86,51.56 v38.93,51.56 | v21.65,47.88 21.65,56.77 v18.22,60.2 | v14.41,60.07 14.41,60.41 D4.A | v40.7,56.9 40.7,55.88 v41.97,54.61
  Bottom 0.254: v75.12,16.64 v71.56,20.19 | v23.56,37.34 v23.56,39.24 | v21.53,45.72 21.53,47.75 v21.65,47.88 | v18.22,60.2 14.54,60.2 v14.41,60.07 | v40.83,62.36 40.58,62.1 40.58,57.02 v40.7,56.9 | v41.97,54.61 v38.93,51.56
DISP_4
  Top 0.254: U1.41 76.03,70.6 77.41,69.22 77.41,56.26 74.49,53.34 58.61,53.34 57.21,54.74 X1.11
DISP_5
  Top 0.254: U1.40 75.64,70.1 76.77,68.96 76.77,56.39 74.36,53.97 60.9,53.97 59.75,55.12 X1.12
DISP_6
  Top 0.254: U1.39 75.25,69.6 76.14,68.71 76.14,56.77 73.98,54.61 63.06,54.61 62.17,55.5 62.17,58.73 X1.13
DISP_7
  Top 0.254: U1.38 74.99,69.1 75.63,68.45 75.63,57.15 73.85,55.37 65.34,55.37 64.83,55.88 X1.14
DISP_E  (via drill 0.3)
  Top 0.254: U1.36 72.18,68.1 v72.33,67.94 | v72.33,65.53 72.33,64.9 73.09,64.14 73.09,58.04 v71.06,56.01 | v71.06,52.07 48.96,52.07 44.51,56.39 X1.6
  Bottom 0.254: v72.33,67.94 v72.33,65.53 | v71.06,56.01 v71.06,52.07
DISP_RS  (via drill 0.3)
  Top 0.254: U1.37 73.58,68.6 v73.85,68.33 | v73.47,64.9 73.72,64.64 73.72,56.52 v73.34,56.13 | v73.34,51.31 44.13,51.31 39.43,55.88 X1.4
  Bottom 0.254: v73.85,68.33 73.85,65.28 v73.47,64.9 | v73.34,56.13 v73.34,51.31
GND  (via drill 0.3)
  Top 0.254: U1.5 v68.51,70.35 68.51,70.1 U1.TAB | U1.43 70.01,71.6 U1.TAB | U1.35 70.01,67.6 U1.TAB | U1.15 66.12,70.6 66.48,70.23 67.37,70.23 U1.TAB | U1.23 65.51,67.1 U1.TAB | U$60.P$2 60.22,71.21 v60.9,71.88 C16.2 | C2.1 v62.04,73.91 | C12.1 v57.72,74.3 | C8.1 v40.96,72.01 | C9.- v45.91,72.26 | v45.91,72.26 | C9.- 47.31,72.26 46.55,73.02 v45.91,73.02 | C9.- 47.31,72.26 46.55,71.5 v45.91,71.5 | v30.67,72.9 U$9.P$17 v30.67,76.2 | v31.94,72.9 U$9.P$16 v31.94,76.2 | v33.21,72.9 U$9.P$15 v33.21,76.2 | v34.48,72.9 U$9.P$14 v34.48,76.2 | v30.67,66.29 30.8,66.29 30.67,66.17 U$9.P$4 v30.67,62.99 | v31.94,66.29 U$9.P$5 v31.94,62.99 | v33.21,66.29 U$9.P$6 v33.21,62.99 | v34.48,66.29 U$9.P$7 v34.48,62.99 | C7.1 23.81,71.63 v23.94,71.5 | C1.1 v64.96,62.74 | U1.TAB 67.88,69.6 v67.37,69.09 | C6.1 v92.27,76.2 | D17.A 99.5,75.06 v99.63,75.18 | v96.08,71.25 96.14,71.31 C11.- 99.06,71.31 99.12,71.25 v99.38,71.25 | v94.68,8.64 94.66,8.65 LED20.3 | C15.2 58.61,67.56 v58.48,67.69 58.52,67.73 U$60.P$4 | U$13.1 54.88,64.09 v54.04,64.01 | C3.1 v74.74,68.2 | C14.2 v66.87,78.49 | C13.2 v74.87,72.14 C4.1 | C5.1 v70.29,81.28 | LED24.3 110.06,67.55 v110.05,67.56 | LED23.3 110.19,48.5 v110.17,48.51 | v110.17,29.46 110.95,29.46 LED22.3 | LED21.3 110.06,10.4 v110.05,10.41 | LED19.3 75.74,8.65 v75.76,8.64 | LED18.3 56.69,8.65 v56.71,8.64 | LED17.3 37.51,8.65 v37.53,8.64 | LED16.3 11.51,10.4 v11.49,10.41 | LED13.3 11.61,67.55 v11.49,67.44 | LED15.3 11.51,29.45 v11.49,29.46 | LED14.3 11.63,48.5 v11.62,48.51
  Bottom 0.254: v60.9,71.88 61.02,71.88 | v62.04,73.91 61.91,73.91 | v57.72,74.3 57.59,74.3 | v40.96,72.01 40.96,72.39 | v45.91,72.26 45.66,72.26 | v45.91,73.02 45.78,73.02 | v45.91,71.5 45.91,71.37 | v30.67,72.9 30.67,72.64 | v31.94,72.9 31.94,72.77 | v33.21,72.9 33.21,72.64 | v34.48,72.9 34.48,72.77 | v30.67,76.2 30.67,76.45 | v31.94,76.2 31.94,76.33 | v33.21,76.2 33.21,76.33 | v34.48,76.2 34.48,76.33 | v30.67,66.29 30.67,66.42 | v31.94,66.29 31.94,66.42 | v33.21,66.29 33.21,66.55 | v34.48,66.29 34.48,66.17 | v30.67,62.99 30.67,62.86 | v31.94,62.99 31.94,62.86 | v33.21,62.99 33.21,62.86 | v34.48,62.99 34.48,63.12 | v23.94,71.5 23.94,71.25 | v64.96,62.74 64.71,62.74 | v67.37,69.09 67.37,69.22 | v68.51,70.35 68.64,70.35 69.02,70.74 | v92.27,76.2 92.27,76.33 92.39,76.45 | v99.63,75.18 99.76,75.18 | v96.08,71.25 95.82,71.25 | v99.38,71.25 99.63,71.25 | v110.05,67.56 109.92,67.56 | v110.17,29.46 110.05,29.46 | v94.68,8.64 94.93,8.64 | v58.48,67.69 58.36,67.69 58.23,67.82 | v54.04,64.01 54.8,62.48 | v74.74,68.2 74.74,67.18 | v66.87,78.49 66.87,78.74 | v74.87,72.14 74.99,72.14 | v70.29,81.28 70.29,80.9 | v110.17,48.51 110.05,48.51 | v110.05,10.41 109.79,10.41 | v75.76,8.64 76.01,8.64 | v56.71,8.64 56.96,8.64 | v37.53,8.64 37.78,8.64 | v11.49,10.41 11.24,10.41 | v11.49,67.44 11.24,67.44 | v11.49,29.46 11.49,29.59 | v11.62,48.51 11.24,48.51
  pour Bottom: -1.59,141.29 117.48,141.29 142.88,-9.52 arc-90 -4.76,-15.88 -1.59,47.62
LED  (via drill 0.3)
  Top 0.254: U1.27 67.51,65.27 67.63,65.15 67.63,63.37 v68.26,62.74 | v69.79,62.1 71.31,60.58 71.31,57.66 70.04,56.39 v65.85,56.39 | v65.21,49.02 65.21,48.39 61.02,44.2 50.74,44.2 49.21,42.67 v40.32,42.67 | v37.4,42.8 26.35,42.8 v23.94,45.21 | v23.94,47.75 v23.94,64.14 | v21.02,64.14 14.2,64.14 LED13.4
  Bottom 0.254: v68.26,62.74 v69.79,62.1 | v65.85,56.39 65.85,49.66 v65.21,49.02 | v40.32,42.67 37.53,42.67 v37.4,42.8 | v23.94,45.21 v23.94,47.75 | v23.94,64.14 v21.02,64.14
M_1  (via drill 0.3)
  Top 0.254: U1.1 70.51,73.49 v70.93,73.91 | v71.95,80.14 70.17,80.14 69.53,80.77 69.53,82.8 68.39,83.95 56.71,83.95 53.78,81.03 49.97,81.03 v49.59,80.64 | v48.2,79.38 47.31,79.38 42.86,83.82 35.37,83.82 34.73,84.45 25.84,84.45 23.3,81.91 23.3,76.71 24.96,75.06 24.96,70.87 28.13,67.69 U$9.P$2
  Bottom 0.254: v70.93,73.91 70.93,74.04 72.33,75.44 72.33,79.76 v71.95,80.14 | v49.59,80.64 49.47,80.64 v48.2,79.38
M_2
  Top 0.254: U1.28 68.01,64.01 69.02,62.99 69.02,61.98 68.39,61.34 45.28,61.34 44.64,61.98 42.23,61.98 41.59,61.34 38.8,61.34 37.02,63.12 U$9.P$9
M_3  (via drill 0.3)
  Top 0.254: U1.29 68.51,64.4 v68.9,64.01 | U$9.P$12 37.02,73.28 37.53,72.77 38.93,72.77 39.56,73.41 42.1,73.41 42.99,72.52 42.99,71.75 46.29,68.45 51.88,68.45 54.55,71.12 56.58,71.12 56.96,70.74 v56.96,68.71
  Bottom 0.254: v68.9,64.01 67.5,64.01 64.96,66.55 61.53,66.55 59.37,68.71 v56.96,68.71
M_4  (via drill 0.3)
  Top 0.254: U1.30 69.01,65.04 v70.17,63.88 | U$9.P$19 28.13,72.77 28.64,72.26 39.56,72.26 40.07,72.77 41.59,72.77 42.35,72.01 42.35,70.99 45.53,67.82 52.01,67.82 54.29,70.1 v56.32,70.1
  Bottom 0.254: v70.17,63.88 63.94,70.1 v56.32,70.1
M_EN1  (via drill 0.3)
  Top 0.254: U1.25 66.51,64.87 66.61,64.77 66.61,62.23 66.23,61.85 50.61,61.85 v50.23,62.1 | U$9.P$1 26.86,62.1 28.26,60.71 41.97,60.71 42.74,61.47 44.26,61.47 45.02,60.71 v50.1,60.71
  Bottom 0.254: v50.23,62.1 50.23,60.83 v50.1,60.71
M_EN2  (via drill 0.3)
  Top 0.254: U1.31 69.51,65.56 71.95,63.12 v71.95,59.69 | U$9.P$11 42.05,74.6 43.5,73.15 43.5,72.26 v43.94,71.82 | U$16.DIR 93.03,49.53 v87.44,49.53 79.06,49.53 v76.9,47.37 | v87.31,51.56 JP2.4 87.31,54.74 86.04,56.01 86.04,58.29 84.39,59.94 78.68,59.94 v78.42,59.69 | v74.23,44.7 69.91,44.7 64.71,39.5 62.17,39.5 58.23,43.43 v51.63,43.43 | v51.63,45.97 51.63,49.02 50.86,49.78 v46.04,49.78 | v46.04,52.2 46.04,53.59 43.24,56.39 v43.24,60.83 | v43.24,63.25 43.24,66.17 v41.34,68.07
  Bottom 0.254: v87.31,51.56 87.31,49.66 v87.44,49.53 | v78.42,59.69 v71.95,59.69 | v76.9,47.37 v74.23,44.7 | v51.63,43.43 v51.63,45.97 | v46.04,49.78 v46.04,52.2 | v43.24,60.83 v43.24,63.25 | v41.34,68.07 41.34,69.22 v43.94,71.82
MISO  (via drill 0.3)
  Top 0.254: U1.11 65.17,72.95 64.45,73.66 v64.45,73.91
  Bottom 0.254: v64.45,73.91 65.98,75.44 65.98,78.61 ISP1.1
MOSI
  Top 0.254: U1.10 66.01,73.5 ISP1.4
N$1
  Top 0.254: SW46.1 10.48,21.8 D1.C
N$2
  Top 0.254: SW47.1 10.48,40.85 D2.C
N$3
  Top 0.254: SW48.1 10.67,54.93 15.68,59.94 15.68,61.89 D3.C
N$4
  Top 0.254: SW49.1 10.48,72.9 10.99,72.39 10.99,70.61 9.33,68.96 9.33,61.93 D4.C
N$5
  Top 0.254: D5.C 30.38,16.09 SW51.1
N$6
  Top 0.254: D6.C 49.43,16.09 SW52.1
N$7
  Top 0.254: D7.C 68.47,16.09 SW53.1
N$8
  Top 0.254: D8.C 117.69,67.67 115.89,69.47 115.89,72.9 114.49,74.3 109.22,74.3 SW55.1
N$9
  Top 0.254: D9.C 107.74,56.09 SW56.1
N$10
  Top 0.254: SW90.1 108.9,37.25 D10.C
N$11
  Top 0.254: SW88.1 103.93,16.83 D11.C
N$12
  Top 0.254: U$15.RST U$15.SLP
N$13
  Top 0.508: U$16.1A JP7.1
N$14
  Top 0.508: U$16.1B 92.39,28.57 JP7.2
N$15
  Top 0.508: U$16.2A 87.31,28.57 JP3.2
N$16
  Top 0.508: U$16.2B 84.77,31.12 JP3.1
N$17
  Top 0.508: U$15.1A 40.32,28.57 JP9.1
N$18
  Top 0.508: U$15.1B 42.86,31.12 JP9.2
N$19
  Top 0.508: U$15.2A JP8.2
N$20
  Top 0.254: SW54.1 83.29,16.83 D20.C
N$21
  Top 0.508: J1.PWR 97.64,77.96 JP6.1
N$22
  Top 0.508: U$17.P$1 55.37,84.58 69.28,84.58 C5.2 71.44,84.71 80.84,84.71 84.26,81.28 84.26,75.44 79.51,70.68 L3.P$2
N$23
  Top 0.508: U$15.2B 35.24,28.57 JP8.1
N$25  (via drill 0.3)
  Top 0.254: U$13.2 54.71,67.22 v54.67,67.18 | v53.53,60.58 53.53,57.28 53.02,56.77 47.18,56.77 v46.16,55.75 | v38.54,55.88 37.78,55.88 36.77,56.9 36.77,58.73 X1.3
  Bottom 0.254: v54.67,67.18 53.78,67.18 53.28,66.67 53.28,60.83 v53.53,60.58 | v46.16,55.75 38.67,55.75 v38.54,55.88
N$26
  Top 0.508: JP4.1 25.72,80.02 25.72,72.26 29.4,68.58 U$9.P$3
N$27  (via drill 0.3)
  Top 0.508: JP4.2 30.8,80.01 30.8,77.98 v30.67,77.85 | v29.65,71.63 33.34,71.63 35.75,69.22 U$9.P$8
  Bottom 0.508: v30.67,77.85 30.16,77.85 29.27,76.96 29.27,72.01 v29.65,71.63
N$28
  Top 0.508: U$9.P$13 35.75,77.47 36.39,78.11 39.14,78.11 JP5.1
N$29
  Top 0.508: JP5.2 33.72,83.44 30.54,83.44 28.89,81.79 28.89,78.49 29.4,77.98 U$9.P$18
N$48
  Top 0.254: LED13.2 15.16,67.55 14.29,66.67 11.49,66.67 10.86,66.04 10.86,59.18 7.81,56.13 7.81,48.89 9.97,46.74 12.52,46.74 LED14.4
N$70
  Top 0.254: LED14.2 15.29,48.5 14.29,47.5 14.29,37.08 11.37,34.16 11.37,31.62 10.35,30.61 10.35,28.83 11.49,27.69 12.52,27.69 LED15.4
N$71
  Top 0.254: LED15.2 15.29,29.45 14.29,28.45 14.29,18.03 11.11,14.86 11.11,11.94 10.35,11.18 10.35,9.78 11.49,8.64 12.52,8.64 LED16.4
N$72
  Top 0.254: LED16.2 30.94,10.4 31.94,9.4 35.67,9.4 LED17.4
N$73
  Top 0.254: LED18.2 53.39,8.65 54.67,7.37 68.39,7.37 70.55,9.52 73.9,9.52 LED19.4
N$74
  Top 0.254: LED19.2 71.3,8.65 72.45,7.49 86.55,7.49 88.58,9.52 92.95,9.52 LED20.4
N$75
  Top 0.254: LED20.2 90.32,8.42 91.5,7.24 109.55,7.24 LED21.4
N$76
  Top 0.254: LED21.2 114.48,10.4 115.89,11.81 115.89,15.24 110.93,20.19 110.93,27.67 LED22.4
N$77
  Top 0.254: LED17.2 33.18,8.29 34.1,7.37 48.83,7.37 50.99,9.52 54.85,9.52 LED18.4
N$80
  Top 0.254: LED24.4 110.96,65.38 112.71,63.63 112.71,57.02 115.25,54.48 115.25,49.29 LED23.2
N$90  (via drill 0.3)
  Top 0.254: LED22.2 114.25,29.45 113.09,30.61 111.32,30.61 110.05,31.88 110.05,34.54 112.2,36.7 112.2,39.24 v113.09,40.13 | v113.09,42.8 113.09,44.62 LED23.4
  Bottom 0.254: v113.09,40.13 v113.09,42.8
N$99
  Top 0.254: R7.2 76.01,77.72 78.3,75.44 80.26,75.44 JP1.D-
N$100
  Top 0.254: R8.2 68.39,78.23 69.66,79.5 76.9,79.5 78.68,81.28 81.09,81.28 82.11,80.26 82.11,79.48 JP1.D+
N$110
  Top 0.254: U1.42 73.06,71.1 C13.1
N$111
  Top 0.254: U1.4 69.01,75.58 R8.1
N$117
  Top 0.254: U1.3 69.51,75.03 69.91,75.44 R7.1
N$118
  Top 0.254: U1.6 68.01,74.93 66.87,76.07 C14.1
N$119
  Top 0.254: U1.17 62.55,69.6 R10.1 61.7,68.75 U$60.P$1 60.13,68.66 C15.1
N$120
  Top 0.254: C16.1 58.52,72.68 U$60.P$3 59.12,70.35 59.12,69.98 59.25,69.85 61.15,69.85 61.91,70.61 R10.2 62.56,70.1 U1.16
RESET
  Top 0.254: R9.1 58.99,80.52 ISP1.5 60.39,79.12 60.39,77.47 62.29,75.56 62.8,75.56 63.69,74.68 63.69,71.88 63.98,71.6 U1.13
ROW1  (via drill 0.3)
  Top 0.254: U1.8 67.01,73.9 65.34,75.56 65.34,75.69 v64.83,76.2 | v60.26,76.2 v50.61,76.2 | v20.13,19.43 20.13,31.24 21.27,32.38 21.27,35.81 v19.88,37.21 | SW47.2 16.83,39.5 17.72,40.39 17.72,45.59 v17.59,45.72 | v17.59,48.01 17.59,56.71 SW48.2 16.83,58.17 17.46,58.8 17.46,63.12 v17.34,63.25 | v17.46,67.18 17.46,75.88 SW49.2 16.7,76.64 16.7,77.22 23.05,83.57 v23.05,84.33 | v48.7,76.2 48.7,77.09 42.74,83.06 39.18,83.06 v39.05,82.93
  Bottom 0.254: v64.83,76.2 v60.26,76.2 | SW46.2 20.07,19.37 v20.13,19.43 | v19.88,37.21 18.03,37.21 SW47.2 | v17.59,45.72 v17.59,48.01 | v17.34,63.25 17.34,67.06 v17.46,67.18 | v50.61,76.2 v48.7,76.2 | v39.05,82.93 37.66,84.33 v23.05,84.33
ROW2  (via drill 0.3)
  Top 0.254: U1.32 70.01,65.69 70.42,65.28 71.18,65.28 72.58,63.88 72.58,58.55 v72.33,58.29 | SW54.2 SW53.2 | SW53.2 SW52.2 55.88,19.37 55.82,19.43 37.53,19.43 SW51.2 | SW53.2 75.56,44.77 72.2,48.13 v72.2,48.01
  Bottom 0.254: v72.2,48.01 72.2,58.17 v72.33,58.29
ROW3  (via drill 0.3)
  Top 0.254: U1.26 67.01,65.14 67.12,65.02 67.12,62.36 v67.25,61.98 | SW88.2 115.32,19.37 116.52,20.57 116.52,30.86 115.76,31.62 115.76,37.91 SW90.2 115.25,39.24 116.4,40.39 116.4,47.62 | 116.4,47.62 116.4,49.91 116.01,50.29 116.01,56.71 SW56.2 115.32,57.4 117.92,57.4 119.32,58.8 119.32,73.02 115.82,76.52 SW55.2 | v68.52,60.71 v68.52,57.15 | v71.06,48.89 73.98,48.89 74.36,48.51 v74.87,48.51 | v79.18,48.51 v92.77,48.51 | v96.33,48.51 103.19,48.51 v104.08,49.4 | v110.17,49.4 111.95,49.4 113.73,47.62 116.4,47.62
  Bottom 0.254: v67.25,61.98 v68.52,60.71 | v68.52,57.15 68.52,51.43 v71.06,48.89 | v74.87,48.51 v79.18,48.51 | v92.77,48.51 v96.33,48.51 | v104.08,49.4 v110.17,49.4
SCLK
  Top 0.254: U1.9 66.51,73.64 62.93,77.22 62.93,78.99 61.66,80.26 ISP1.3
VBUS  (via drill 0.3)
  Top 0.254: v76.14,76.07 76.08,76.02 SJ1.1 73.27,75.95 v71.18,75.95 | v78.04,77.34 79.66,77.34 JP1.VBUS | U1.7 67.51,74.29 v67.37,74.42
  Bottom 0.254: v76.14,76.07 76.77,76.07 v78.04,77.34 | v67.37,74.42 68.9,75.95 v71.18,75.95